# EAGLE design test1 (EAGLE 7.3.0)
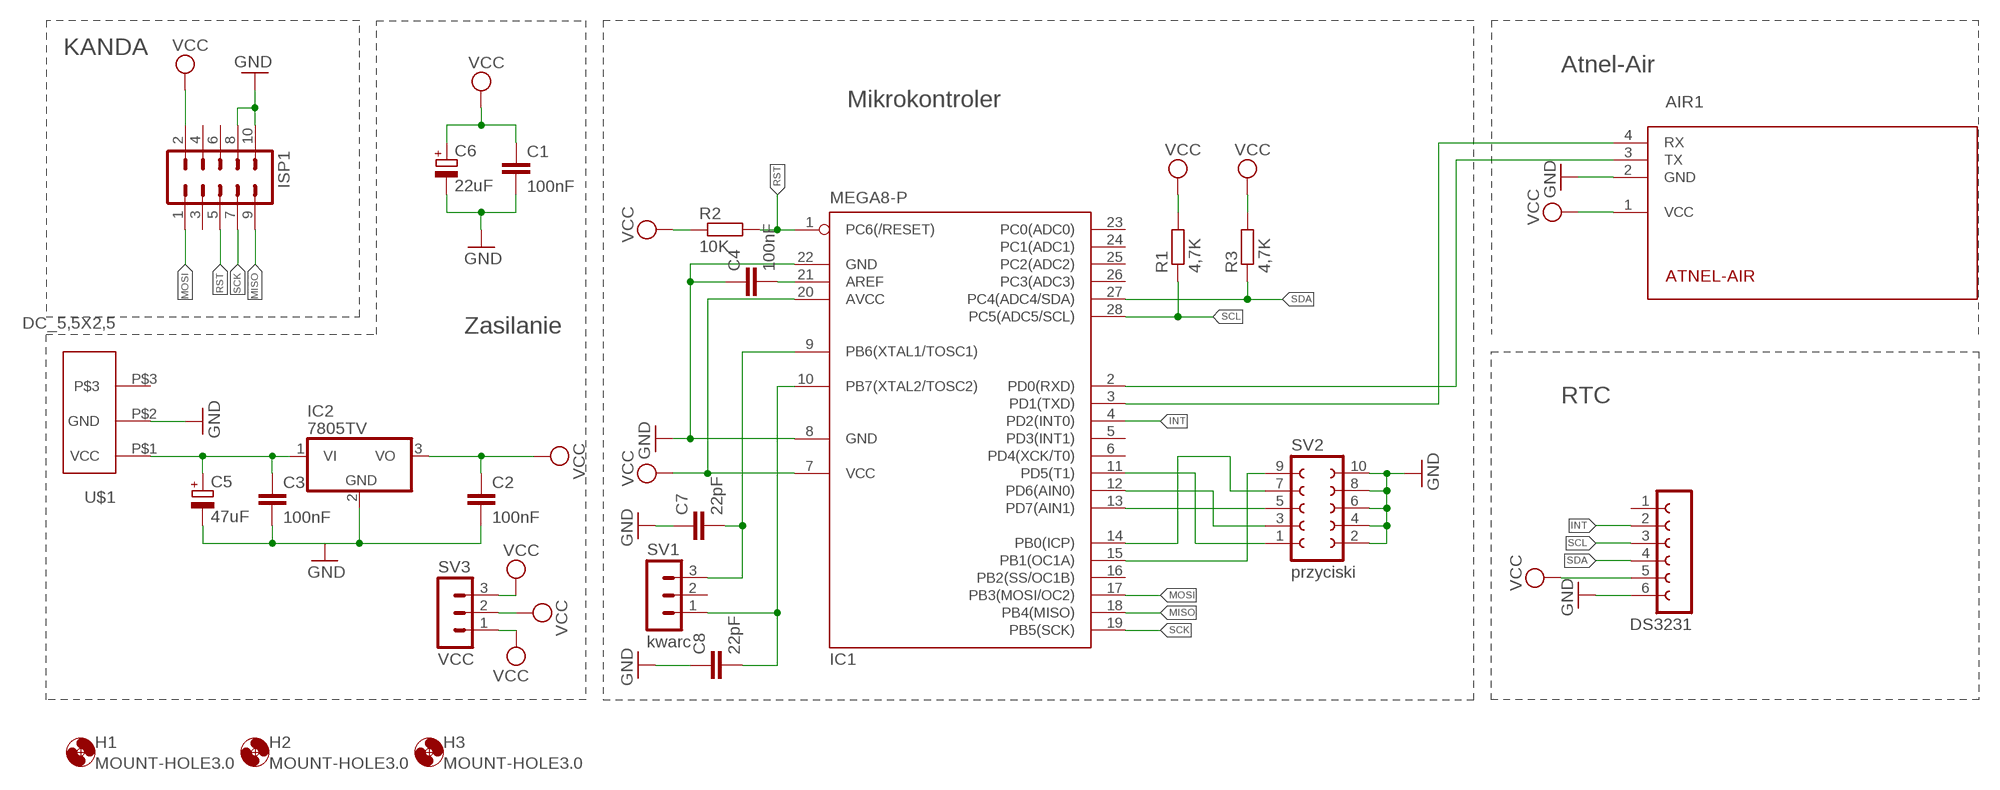
[diagram p0: schematic, sheet 1]

## Parts
AIR1  ATNEL-AIR  [ATNEL-AIR]
C1  100nF  C-EU025-024X044  [C025-024X044]
C2  100nF  C-EU025-024X044  [C025-024X044]
C3  100nF  C-EU025-024X044  [C025-024X044]
C4  100nF  C-EU025-024X044  [C025-024X044]
C5  47uF  CPOL-EUB45181A  [B45181A]
C6  22uF  CPOL-EUB45181A  [B45181A]
C7  22pF  C-EU025-024X044  [C025-024X044]
C8  22pF  C-EU025-024X044  [C025-024X044]
DS3231  FE06-1  [FE06]
H1  MOUNT-HOLE3.0  [3,0]
H2  MOUNT-HOLE3.0  [3,0]
H3  MOUNT-HOLE3.0  [3,0]
IC1  MEGA8-P  [DIL28-3]
IC2  7805TV  [TO220V]
ISP1  ML10  [ML10]
R1  4,7K  R-EU_0204/7  [0204/7]
R2  10K  R-EU_0204/7  [0204/7]
R3  4,7K  R-EU_0204/7  [0204/7]
SV1  kwarc  MA03-1  [MA03-1]
SV2  przyciski  FE05-2  [FE05-2]
SV3  VCC  MA03-1  [MA03-1]
U$1  DC_5,5X2,5  [DC_5,5X2,5]

## Nets
GND: AIR1.2(GND) C1.2 C2.2 C3.2 C4.1 C5.- C6.- C7.1 C8.1 DS3231.6 IC1.8(GND) IC1.22(GND) IC2.2(GND) ISP1.8 ISP1.10 SV2.2 SV2.4 SV2.6 SV2.8 SV2.10 U$1.P$2(GND)
INT: DS3231.2 IC1.4(PD2(INT0))
MISO: IC1.18(PB4(MISO)) ISP1.9
MOSI: IC1.17(PB3(MOSI/OC2)) ISP1.1
N$1: AIR1.3(TX) IC1.2(PD0(RXD))
N$2: AIR1.4(RX) IC1.3(PD1(TXD))
N$3: IC1.13(PD7(AIN1)) SV2.5
N$4: IC1.14(PB0(ICP)) SV2.7
N$5: IC1.12(PD6(AIN0)) SV2.3
N$6: C3.1 C5.+ IC2.1(VI) U$1.P$1(VCC)
N$7: IC1.15(PB1(OC1A)) SV2.9
N$8: IC1.11(PD5(T1)) SV2.1
N$9: C4.2 IC1.21(AREF)
N$10: C7.2 IC1.9(PB6(XTAL1/TOSC1)) SV1.3
N$11: C8.2 IC1.10(PB7(XTAL2/TOSC2)) SV1.1
RST: IC1.1(PC6(/RESET)) ISP1.5 R2.2
SCK: IC1.19(PB5(SCK)) ISP1.7
SCL: DS3231.3 IC1.28(PC5(ADC5/SCL)) R1.1
SDA: DS3231.4 IC1.27(PC4(ADC4/SDA)) R3.1
VCC: AIR1.1(VCC) C1.1 C2.1 C6.+ DS3231.5 IC1.7(VCC) IC1.20(AVCC) IC2.3(VO) ISP1.2 R1.2 R2.1 R3.2 SV3.1 SV3.2 SV3.3
Unconnected: DS3231.1 IC1.5(PD3(INT1)) IC1.6(PD4(XCK/T0)) IC1.16(PB2(SS/OC1B)) IC1.23(PC0(ADC0)) IC1.24(PC1(ADC1)) IC1.25(PC2(ADC2)) IC1.26(PC3(ADC3)) ISP1.3 ISP1.4 ISP1.6 SV1.2 U$1.P$3

## Notes on the sheet
- KANDA
- Atnel-Air
- Mikrokontroler
- Zasilanie
- RTC

## Library data of the parts
AIR1 = ATNEL-WIFI232-T:ATNEL-AIR
C1-C4 C7 C8 = rcl:C-EU: CAPACITOR, European symbol
C5 C6 = rcl:CPOL-EU: POLARIZED CAPACITOR, European symbol
DS3231 = con-lsta:FE06-1: FEMALE HEADER; OC_FARNELL: unknown; OC_NEWARK: unknown
H1-H3 = holes:MOUNT-HOLE: MOUNTING HOLE with drill center marker
IC1 = atmel:MEGA8-P: MICROCONTROLLER 8 Kbytes FLASH, 1 kbytes SRAM, 512 bytes EEPROM, USART, 4-channel 10 bit ADC, 2-channel 8 bit ADC Pin compatible with Atmega48, ATMega88, ATMega168 Source: avr.lbr; OC_FARNELL: unknown; OC_NEWARK: unknown
IC2 = linear:78*: Positive VOLTAGE REGULATOR Source: http://cache.national.com/ds/LM/LM78L05.pdf http://www.fairchildsemi.com/ds/LM/LM7805.pdf
ISP1 = con-harting-ml:ML10: HARTING; OC_FARNELL: unknown; OC_NEWARK: unknown
R1-R3 = resistor:R-EU_: RESISTOR, European symbol
SV1 SV3 = con-lstb:MA03-1: PIN HEADER; OC_FARNELL: unknown; OC_NEWARK: unknown
SV2 = con-lsta:FE05-2: FEMALE HEADER; OC_FARNELL: unknown; OC_NEWARK: unknown
U$1 = wachcio:DC_5,5X2,5

## Board
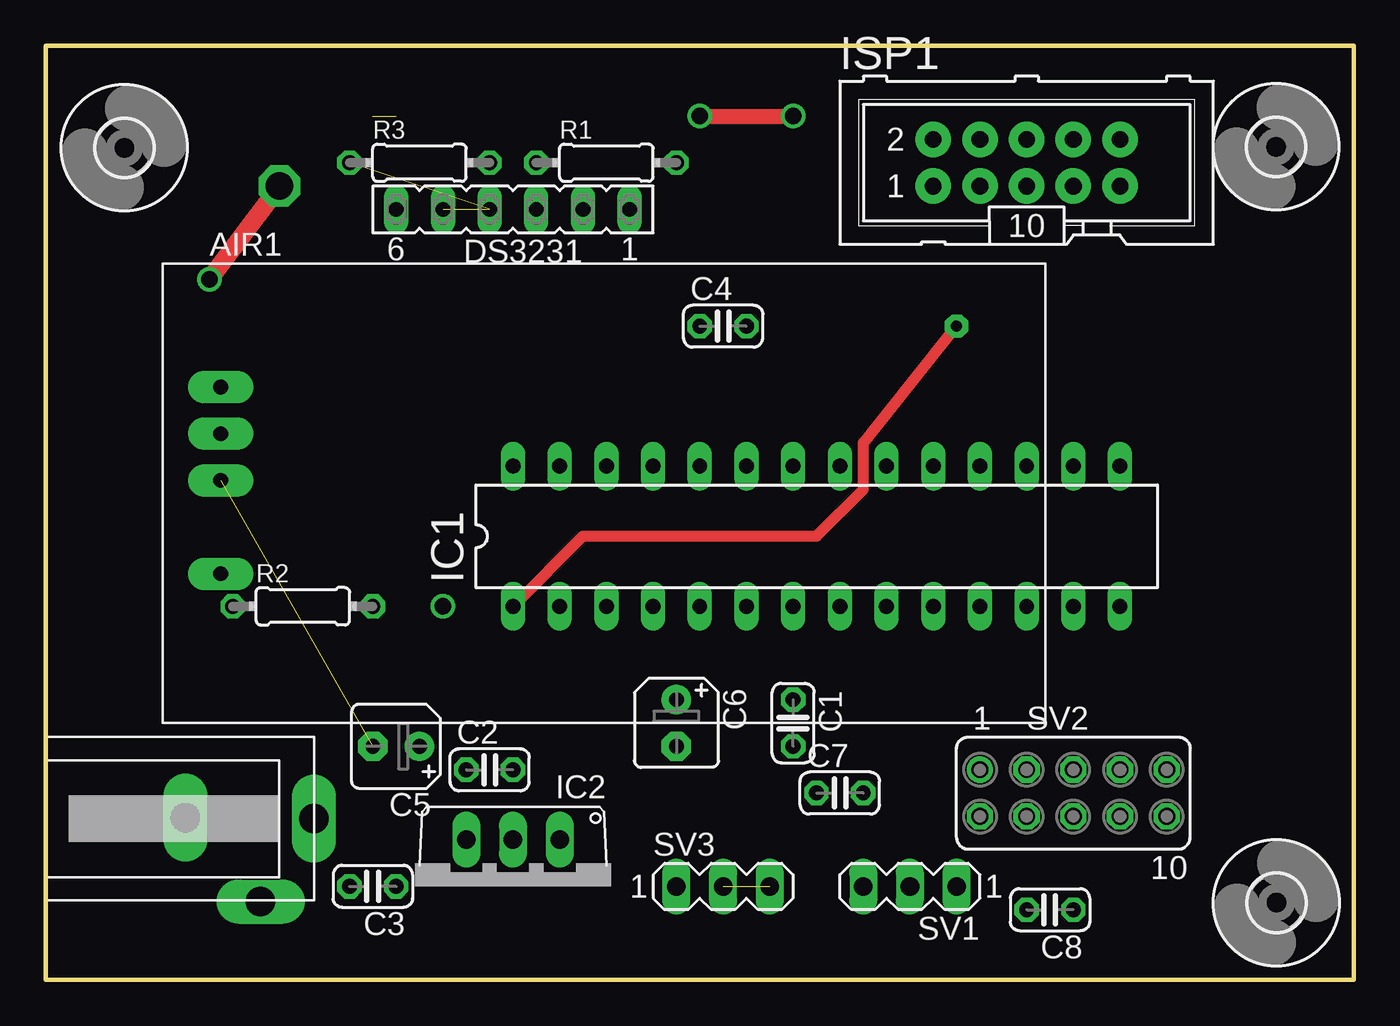
[diagram p1: board, top side]
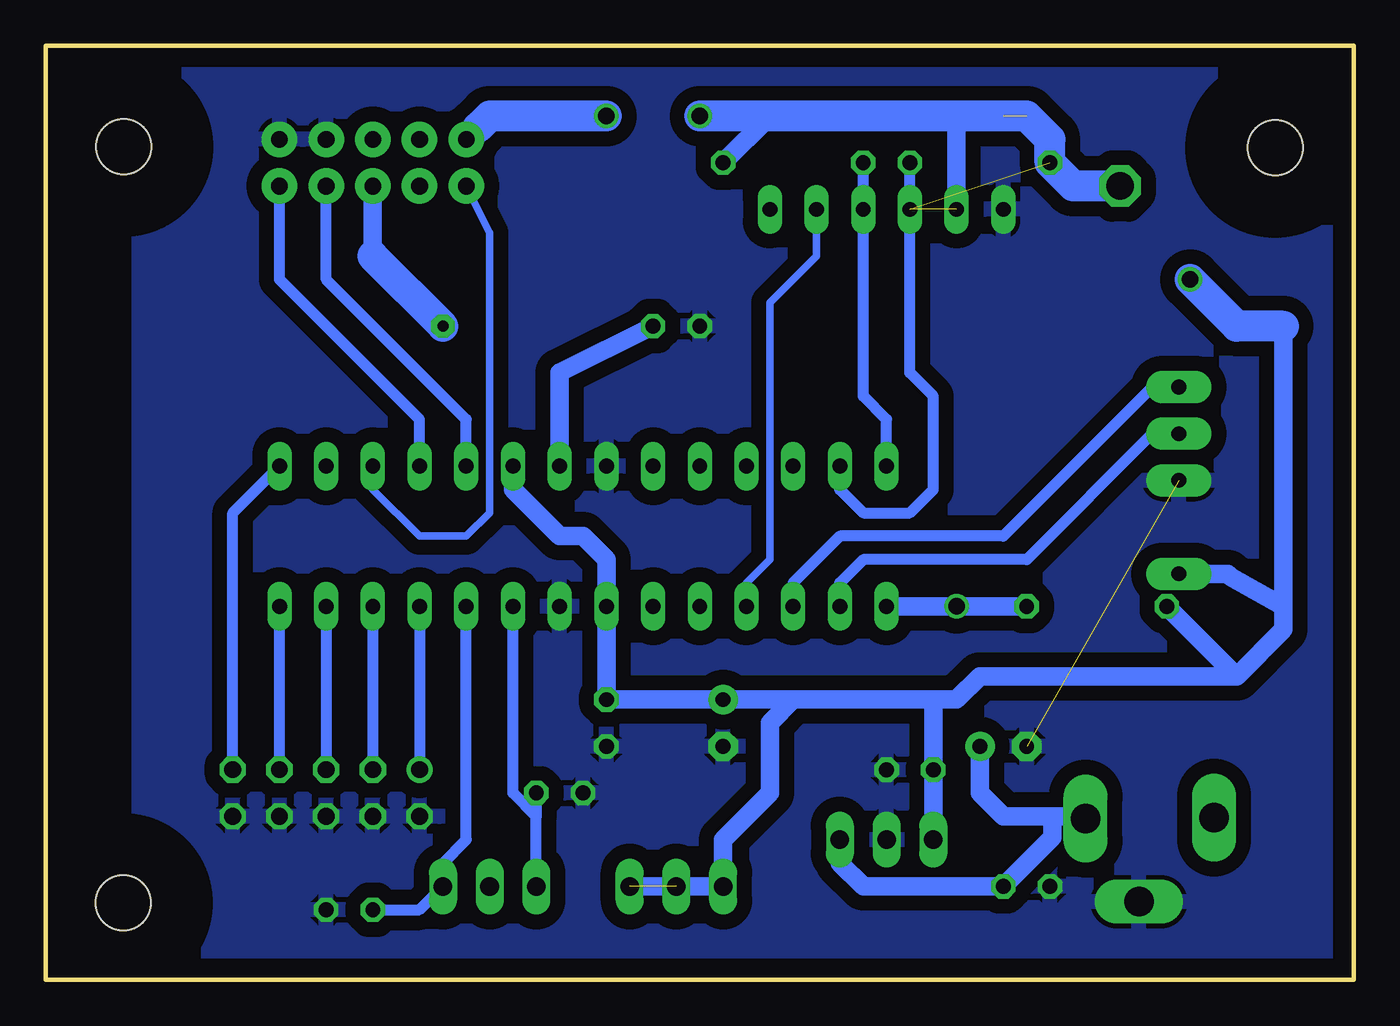
[diagram p2: board, bottom side, seen from below]

Size 71.12 x 50.8 mm. Coordinates in mm from the lower left corner, seen from the top.
Outline: 60.96,0 71.12,0
Outline: 71.12,0 0,0 0,50.8 71.12,50.8 71.12,0
Copper layers (1*16): Top 0.035mm / dielectric 1.5mm / Bottom 0.035mm
Design rules "default": minimum track width 10mil, minimum drill 24mil, track to track 8mil, track to pad 8mil, pad to pad 8mil, via to via 8mil, smd to smd 8mil, copper to edge 40mil, drill to drill 8mil, minimum pad ring 10mil, minimum via ring 8mil, stop-mask expansion 4mil, vias tented up to drill 0mil, thermal gap 10mil

### Footprints (pad centres in the part's own frame; a part is rotated, then mirrored left to right if it is on the bottom)
ATNEL-AIR = drill 0.8 pad 1.778 long: 1 3.15,8.12; 2 3.15,13.2; 3 3.15,15.74; 4 3.15,18.28
C025-024X044 = drill 0.813 octagon: 1 -1.27,0; 2 1.27,0
B45181A = drill 0.813 pad 1.6: + -1.27,0 | drill 0.813 pad 1.6 octagon: - 1.27,0
FE06 = drill 0.813 long: 1 -6.35,0; 2 -3.81,0; 3 -1.27,0; 4 1.27,0; 5 3.81,0; 6 6.35,0
3,0 = hole 3: 0,0
DIL28-3 = drill 0.813 long: 1 -16.51,-3.81; 2 -13.97,-3.81; 3 -11.43,-3.81; 4 -8.89,-3.81; 5 -6.35,-3.81; 6 -3.81,-3.81; 7 -1.27,-3.81; 8 1.27,-3.81; 9 3.81,-3.81; 10 6.35,-3.81; 11 8.89,-3.81; 12 11.43,-3.81; 13 13.97,-3.81; 14 16.51,-3.81; 15 16.51,3.81; 16 13.97,3.81; 17 11.43,3.81; 18 8.89,3.81; 19 6.35,3.81; 20 3.81,3.81; 21 1.27,3.81; 22 -1.27,3.81; 23 -3.81,3.81; 24 -6.35,3.81; 25 -8.89,3.81; 26 -11.43,3.81; 27 -13.97,3.81; 28 -16.51,3.81
TO220V = drill 1.016 long: 1 -2.54,-2.54; 2 0,-2.54; 3 2.54,-2.54
ML10 = drill 0.914 pad 1.93: 1 -5.08,-1.27; 2 -5.08,1.27; 3 -2.54,-1.27; 4 -2.54,1.27; 5 0,-1.27; 6 0,1.27; 7 2.54,-1.27; 8 2.54,1.27; 9 5.08,-1.27; 10 5.08,1.27
0204/7 = drill 0.813 octagon: 1 -3.81,0; 2 3.81,0
MA03-1 = drill 1.016 long: 1 -2.54,0; 2 0,0; 3 2.54,0
FE05-2 = drill 0.914: 1 -5.08,1.27 | drill 0.914 octagon: 2 -5.08,-1.27; 3 -2.54,1.27; 4 -2.54,-1.27; 5 0,1.27; 6 0,-1.27; 7 2.54,1.27; 8 2.54,-1.27; 9 5.08,1.27; 10 5.08,-1.27
DC_5,5X2,5 = drill 1.6 long: P$1 14.605,4.445; P$2 11.7,-0.07; P$3 7.6,4.5

### Placement (x,y rotation side)
AIR1  6.35,13.97 0 top
C1  40.64,13.97 270 top
C2  24.13,11.43 0 top
C3  17.78,5.08 180 top
C4  36.83,35.56 0 top
C5  19.05,12.7 180 top
C6  34.29,13.97 270 top
C7  43.18,10.16 0 top
C8  54.61,3.81 180 top
DS3231  25.4,41.91 180 top
H1  4.27,45.26 0 top
H2  66.9,45.31 0 top
H3  66.93,4.19 0 top
IC1  41.91,24.13 0 top
IC2  25.4,5.08 180 top
ISP1  53.34,44.45 0 top
R1  30.48,44.45 0 top
R2  13.97,20.32 0 top
R3  20.32,44.45 0 top
SV1  46.99,5.08 180 top
SV2  55.88,10.16 0 top
SV3  36.83,5.08 0 top
U$1  -0.03,4.32 0 top

### Tracks (layer width: path | path; a pad name or v marks a point on that pad's centre or on a via)
GND  (1 unrouted)
  pour Bottom (isolate 0.813): -1.27,0 66.04,0 66.04,52.07 -1.27,52.07
INT
  Bottom 0.406: IC1.4 33.02,21.59 31.75,22.86 31.75,36.83 29.21,39.37 DS3231.2
MISO
  Bottom 0.61: IC1.18 50.8,30.48 58.42,38.1 ISP1.9
MOSI
  Bottom 0.406: IC1.17 53.34,26.67 50.8,24.13 48.26,24.13 46.99,25.4 46.99,40.64 ISP1.1
N$1
  Bottom 0.61: IC1.2 27.94,21.59 26.67,22.86 17.78,22.86 10.93,29.71 AIR1.3
N$2
  Bottom 0.61: IC1.3 30.48,21.59 27.94,24.13 19.05,24.13 10.93,32.25 AIR1.4
N$3
  Bottom 0.61: IC1.13 SV2.5
N$4
  Bottom 0.61: SV2.7 IC1.14
N$5
  Bottom 0.61: IC1.12 SV2.3
N$6
  Bottom 0.61: 16.38,8.76 U$1.P$1 14.71,8.89
  Bottom 1.016: IC2.1 27.94,6.35 26.67,5.08 C3.1 16.38,7.75 16.38,8.76 | C5.+ 20.32,10.16 19.05,8.89 14.71,8.89
N$7
  Bottom 0.61: SV2.9 60.96,25.4 IC1.15
N$8
  Bottom 0.61: IC1.11 SV2.1
N$9
  Bottom 1.016: IC1.21 43.18,33.02 C4.2
N$10
  Bottom 0.61: SV1.3 44.45,8.89 | 44.45,8.89 45.72,10.16 IC1.9 | C7.2 44.45,8.89
N$11
  Bottom 0.61: IC1.10 48.26,7.62 49.53,6.35 SV1.1 50.8,3.81 C8.2
RST  (via drill 0.6 pad 1.27, 0.9 pad 1.02)
  Top 0.61: IC1.1 29.21,24.13 41.91,24.13 44.45,26.67 44.45,29.21 v49.53,35.56
  Bottom 1.016: 53.34,39.37 ISP1.5 | R2.2 v21.59,20.32 IC1.1
  Bottom 1.676: 53.34,39.37 v49.53,35.56
SCK
  Bottom 0.61: IC1.19 48.26,30.48 55.88,38.1 ISP1.7
SCL
  Bottom 0.61: R1.1 DS3231.3 26.67,31.75 25.4,30.48 IC1.28
SDA  (1 unrouted)
  Bottom 0.61: IC1.27 27.94,26.67 26.67,25.4 24.13,25.4 22.86,26.67 22.86,31.75 24.13,33.02 DS3231.4
VCC  (via drill 0.9, 1.5)  (3 unrouted)
  Top 0.813: v35.56,46.99 v40.64,46.99
  Top 1.016: v8.89,38.1 v12.7,43.18
  Bottom 0.61: 24.13,41.91 R3.2
  Bottom 0.813: 47.62,46.35 ISP1.2
  Bottom 1.016: 6.35,16.51 20.32,16.51 21.59,15.24 22.86,15.24 | IC1.20 45.72,26.67 43.18,24.13 41.91,24.13 40.64,22.86 IC1.7 C1.1 C6.+ 30.48,15.24 | 19.05,46.99 21.59,46.99 | 21.59,46.99 31.75,46.99 R1.2 | SV3.3 SV3.1 34.29,7.62 31.75,10.16 31.75,13.97 30.48,15.24 | R2.1 6.35,16.51 | IC2.3 C2.1 22.86,15.24 | 3.81,35.56 3.81,20.32 | 3.81,20.32 3.81,19.05 6.35,16.51 | 3.81,20.32 6.67,21.91 6.85,22.09 AIR1.1 | DS3231.5 21.59,46.99 | 22.86,15.24 30.48,15.24
  Bottom 1.676: 3.81,35.56 6.35,35.56 v8.89,38.1 | v12.7,43.18 15.24,43.18 16.51,44.45 16.51,45.72 17.78,46.99 v35.56,46.99 | v40.64,46.99 46.99,46.99 47.62,46.35

### Text on the board
bTest: WACHCIO 12.2015 (V2)